# EAGLE schematic feather-load-tester-relabeled (EAGLE 6.6.0)
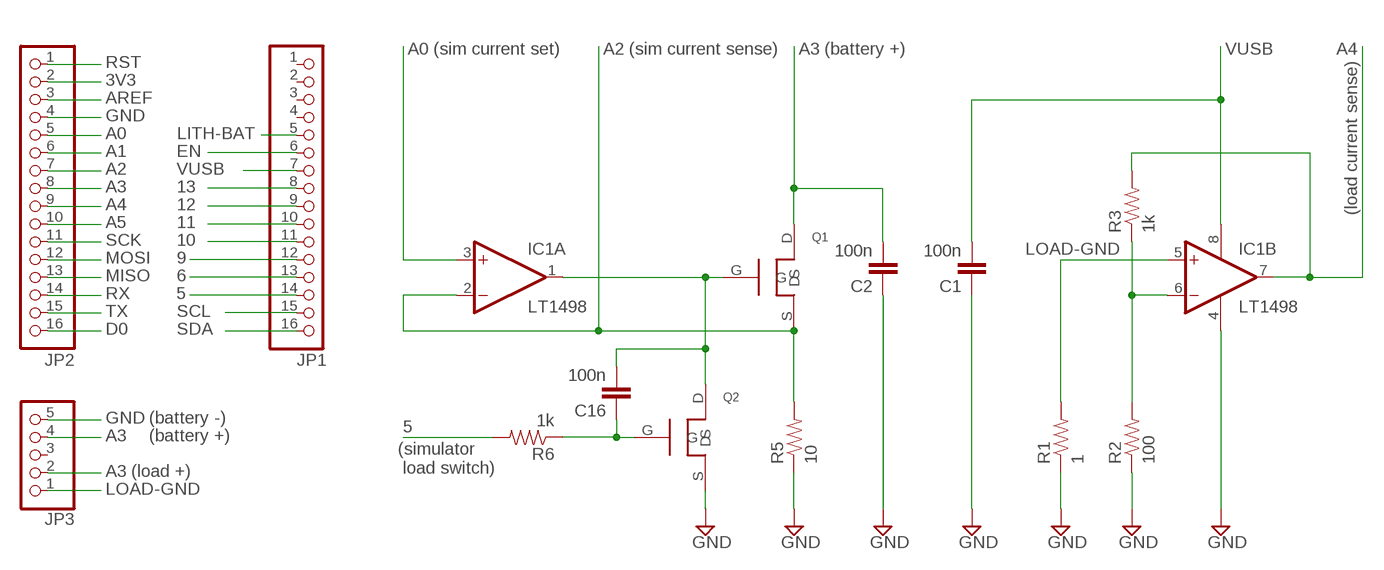
[diagram p0: schematic, sheet 1]

## Parts
C1  100n  0.33UF-50V-10%(0805)  [0805-CAP]
C2  100n  0.33UF-50V-10%(0805)  [0805-CAP]
C16  100n  0.33UF-50V-10%(0805)  [0805-CAP]
IC1  LT1498  2AMP_P8+4D  [SO08]
JP1  PINHD-1X16  [1X16]
JP2  PINHD-1X16  [1X16]
JP3  PINHD-1X5  [1X05]
Q1  NMOSFET_SC59  [SC59]
Q2  NMOSFET_SC59  [SC59]
R1  1  0.22OHM-1/4W-1%(0805)  [0805]
R2  100  0.22OHM-1/4W-1%(0805)  [0805]
R3  1k  0.22OHM-1/4W-1%(0805)  [0805]
R5  10  0.22OHM-1/4W-1%(0805)  [0805]
R6  1k  0.22OHM-1/4W-1%(0805)  [0805]

## Nets
3V3: JP2.2
5: JP1.14 R6.2
6: JP1.13
9: JP1.12
10: JP1.11
11: JP1.10
12: JP1.9
13: JP1.8
A0: IC1.3(A:+IN) JP2.5
A1: JP2.6
A2: IC1.2(A:-IN) JP2.7 Q1.S R5.2
A3: C2.2 JP2.8 JP3.2 JP3.4 Q1.D
A4: IC1.7(B:OUT) JP2.9 R3.2
A5: JP2.10
AREF: JP2.3
D0: JP2.16
EN: JP1.6
GND: C1.1 C2.1 IC1.4(P:V-) JP2.4 JP3.5 Q2.S R1.1 R2.1 R5.1
LITH-BAT: JP1.5
LOAD-GND: IC1.5(B:+IN) JP3.1 R1.2
MISO: JP2.13
MOSI: JP2.12
N$4: IC1.6(B:-IN) R2.2 R3.1
N$7: C16.1 Q2.G R6.1
N$9: C16.2 IC1.1(A:OUT) Q1.G Q2.D
RST: JP2.1
RX: JP2.14
SCK: JP2.11
SCL: JP1.15
SDA: JP1.16
TX: JP2.15
VUSB: C1.2 IC1.8(P:V+) JP1.7
Unconnected: JP1.1 JP1.2 JP1.3 JP1.4 JP3.3

## Notes on the sheet
- (sim current set) | (sim current sense) | (battery +)
- (load current sense)
- (battery -)
- (battery +)
- (simulator
   load switch)
- (load +)

## Library data of the parts
C1 C2 C16 = SparkFun-Capacitors:0.33UF-50V-10%(0805): CAP-08469; PROD_ID: CAP-08469; VALUE: 0.33uF
IC1 = linear:2AMP_P8+4: OP AMP
JP1 JP2 = pinhead:PINHD-1X16: PIN HEADER
JP3 = pinhead:PINHD-1X5: PIN HEADER
Q1 Q2 = sivan-new:NMOSFET_*; MANUFACTURER: Diodes Inc.; MPN: DMN1019UFDE-7
R1-R3 R5 R6 = SparkFun-Resistors:0.22OHM-1/4W-1%(0805): RES-09883; PROD_ID: RES-09883; VALUE: 0.22